# EAGLE schematic bin-clock (EAGLE 6.5.0)
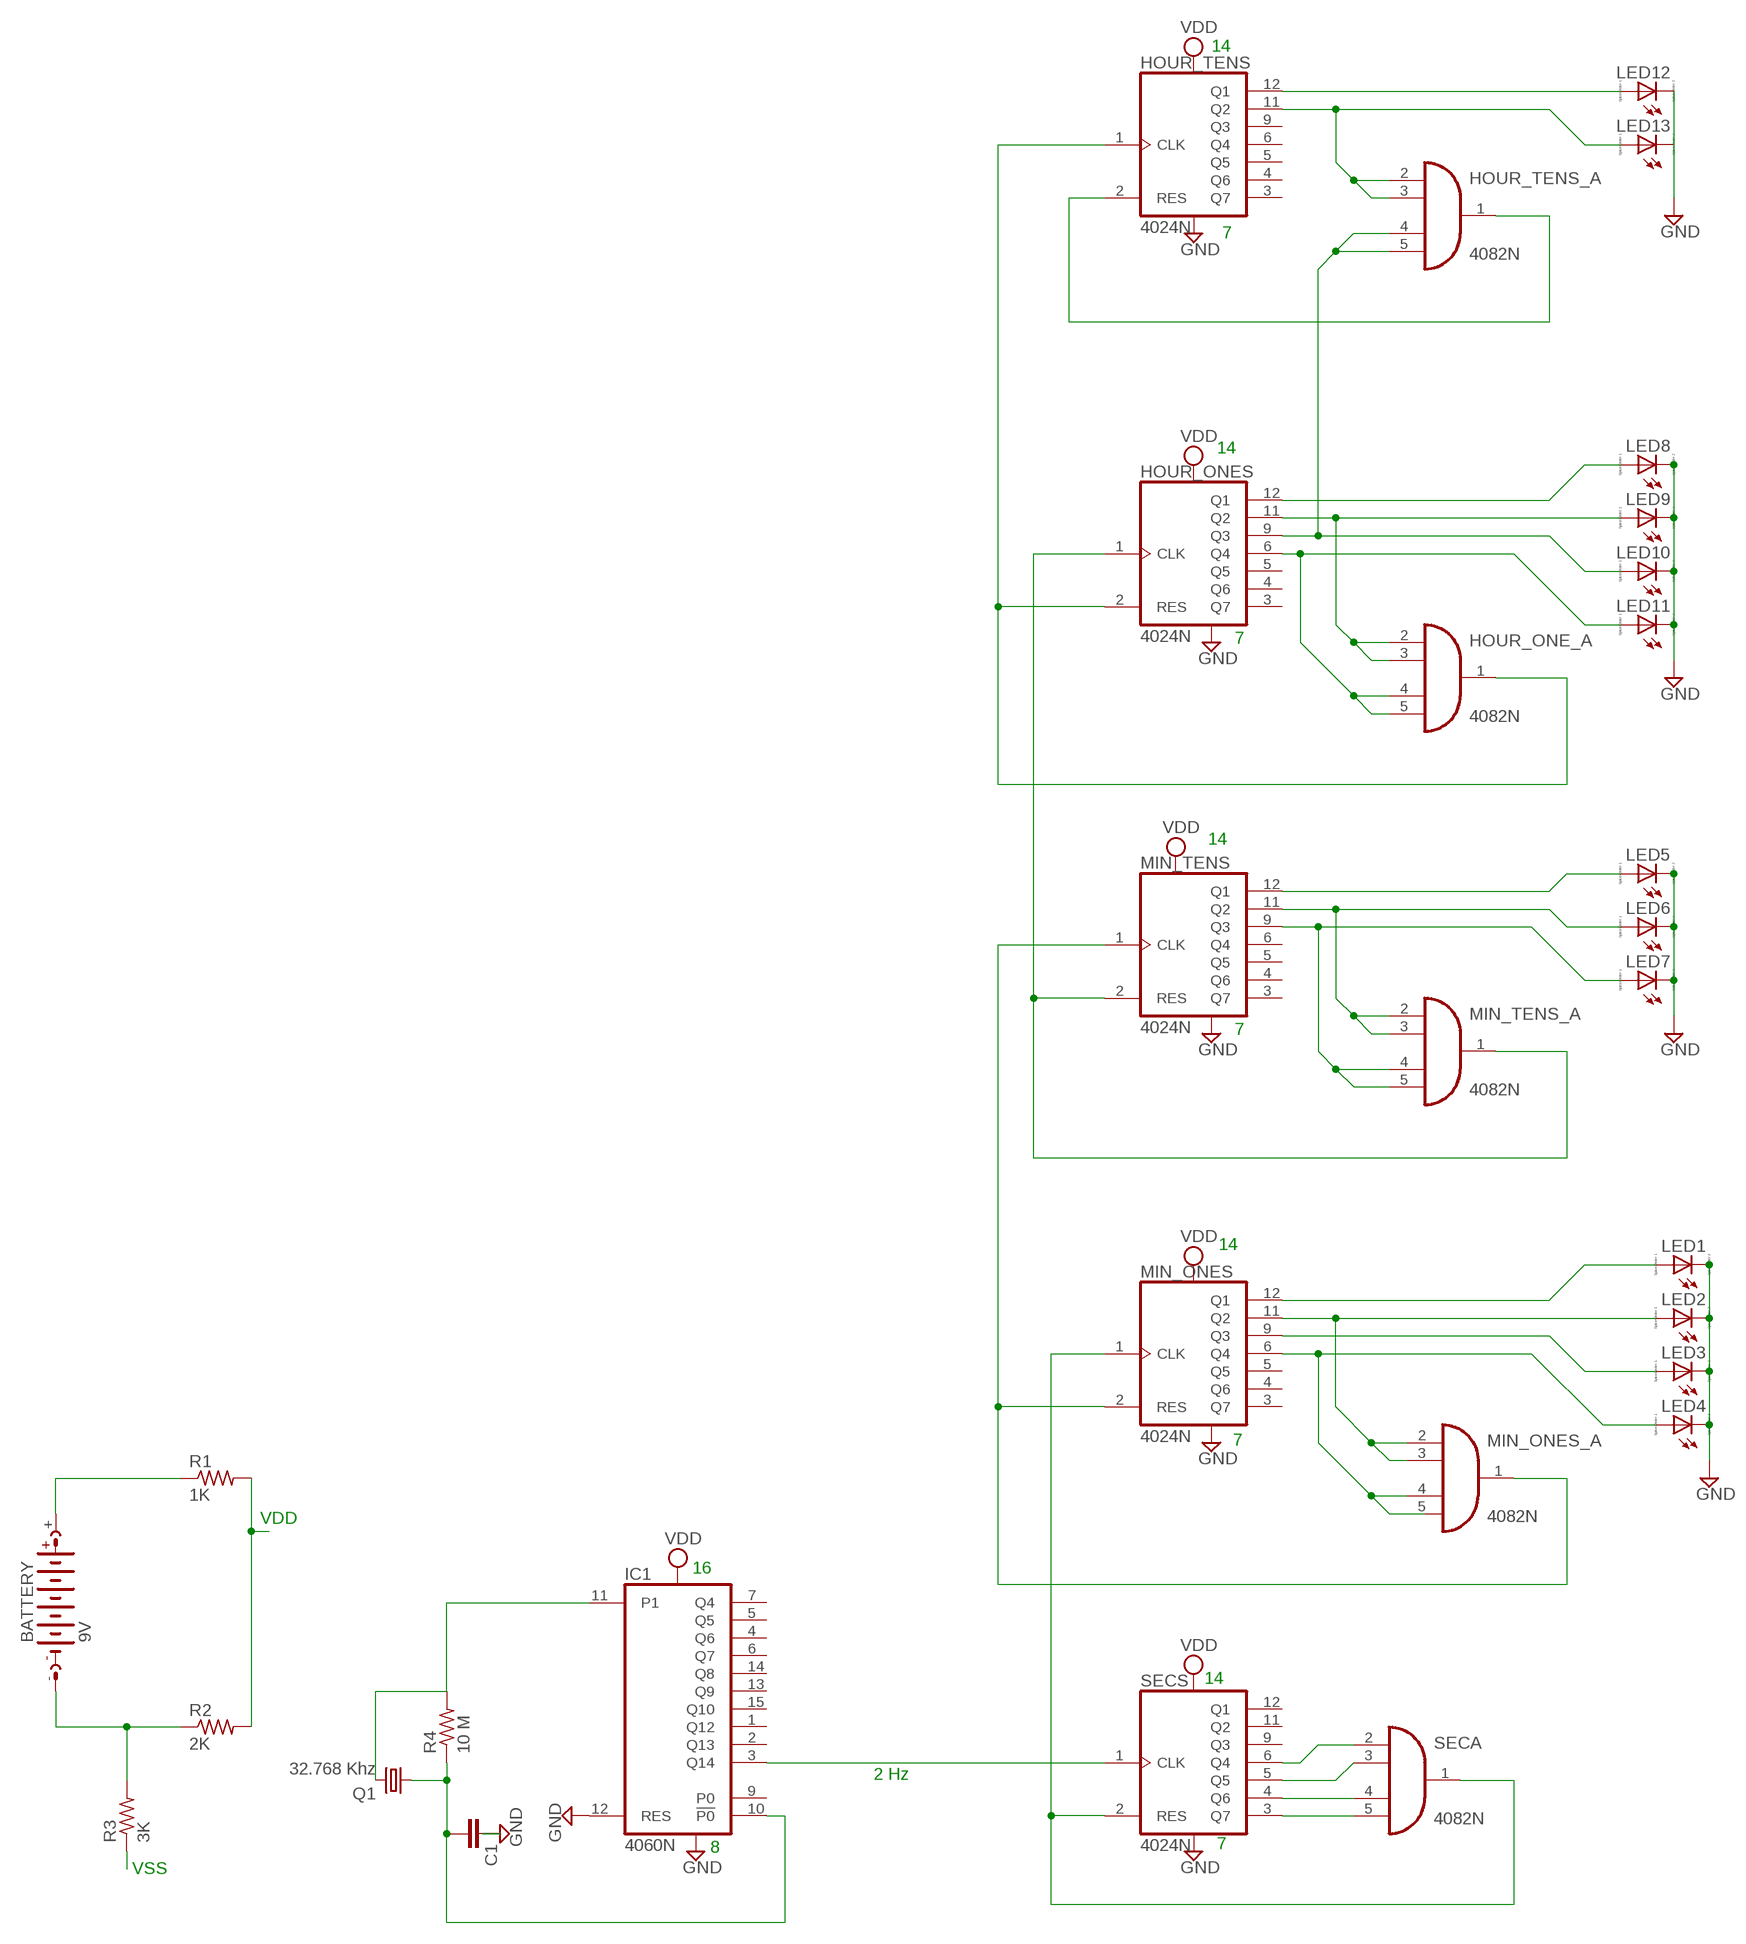
[diagram p0: schematic, sheet 1]

## Parts
BATTERY  9V  AB9V  [AB9V]
C1  C2,5-3  [C2.5-3]
HOUR_ONE_  4082N  [DIL14]
HOUR_ONES  4024N  [DIL14]
HOUR_TENS  4024N  [DIL14]
HOUR_TENS_  4082N  [DIL14]
IC1  4060N  [DIL16]
LED1  LED_ELD260  [LED_LD260]
LED2  LED_ELD260  [LED_LD260]
LED3  LED_ELD260  [LED_LD260]
LED4  LED_ELD260  [LED_LD260]
LED5  LED_ELD260  [LED_LD260]
LED6  LED_ELD260  [LED_LD260]
LED7  LED_ELD260  [LED_LD260]
LED8  LED_ELD260  [LED_LD260]
LED9  LED_ELD260  [LED_LD260]
LED10  LED_ELD260  [LED_LD260]
LED11  LED_ELD260  [LED_LD260]
LED12  LED_ELD260  [LED_LD260]
LED13  LED_ELD260  [LED_LD260]
MIN_ONES  4024N  [DIL14]
MIN_ONES_  4082N  [DIL14]
MIN_TENS  4024N  [DIL14]
MIN_TENS_  4082N  [DIL14]
Q1  32.768 Khz  CRYSTAL68SMX  [86SMX]
R1  1K  R-US_0204/2V  [0204V]
R2  2K  R-US_0204/2V  [0204V]
R3  3K  R-US_0204/2V  [0204V]
R4  10 M  R-US_0204/2V  [0204V]
SEC  4082N  [DIL14]
SECS  4024N  [DIL14]

## Nets
GND: C1.1 IC1.12(RES) LED1.K(C) LED2.K(C) LED3.K(C) LED4.K(C) LED5.K(C) LED6.K(C) LED7.K(C) LED8.K(C) LED9.K(C) LED10.K(C) LED11.K(C) LED12.K(C)
N$1: BATTERY.+ R1.1
N$2: BATTERY.- R2.1 R3.2
N$3: R3.1
N$4: IC1.3(Q14)
N$5: C1.2 IC1.10(!P0) Q1.1 R4.1
N$6: IC1.11(P1) Q1.4 R4.2
N$7: R1.2 R2.2
N$8: SEC.2(A:I0) SECS.6(Q4)
N$9: SEC.3(A:I1) SECS.5(Q5)
N$10: SEC.4(A:I2) SECS.4(Q6)
N$11: SEC.5(A:I3) SECS.3(Q7)
N$12: MIN_ONES.1(CLK) SEC.1(A:O) SECS.2(RES)
N$13: LED1.A MIN_ONES.12(Q1)
N$14: HOUR_ONES.1(CLK) MIN_TENS.2(RES) MIN_TENS_.1(A:O)
N$15: LED3.A MIN_ONES.9(Q3)
N$16: LED4.A MIN_ONES.6(Q4) MIN_ONES_.4(A:I2)
N$17: MIN_ONES.2(RES) MIN_ONES_.1(A:O) MIN_TENS.1(CLK)
N$18: LED5.A MIN_TENS.12(Q1)
N$19: LED6.A MIN_TENS.11(Q2) MIN_TENS_.2(A:I0) MIN_TENS_.3(A:I1)
N$20: LED7.A MIN_TENS.9(Q3) MIN_TENS_.4(A:I2) MIN_TENS_.5(A:I3)
N$21: LED2.A MIN_ONES.11(Q2) MIN_ONES_.2(A:I0) MIN_ONES_.3(A:I1)
N$22: HOUR_ONES.12(Q1) LED8.A
N$23: HOUR_ONE_.2(A:I0) HOUR_ONE_.3(A:I1) HOUR_ONES.11(Q2) LED9.A
N$24: HOUR_ONES.9(Q3) HOUR_TENS_.4(A:I2) HOUR_TENS_.5(A:I3) LED10.A
N$25: HOUR_ONE_.4(A:I2) HOUR_ONE_.5(A:I3) HOUR_ONES.6(Q4) LED11.A
N$26: HOUR_ONE_.1(A:O) HOUR_ONES.2(RES) HOUR_TENS.1(CLK)
N$27: HOUR_TENS.12(Q1) LED12.A
N$28: HOUR_TENS.11(Q2) HOUR_TENS_.2(A:I0) HOUR_TENS_.3(A:I1) LED13.A
N$29: HOUR_TENS.2(RES) HOUR_TENS_.1(A:O)
Unconnected: HOUR_ONE_.9(B:I0) HOUR_ONE_.10(B:I1) HOUR_ONE_.11(B:I2) HOUR_ONE_.12(B:I3) HOUR_ONE_.13(B:O) HOUR_ONES.3(Q7) HOUR_ONES.4(Q6) HOUR_ONES.5(Q5) HOUR_TENS.3(Q7) HOUR_TENS.4(Q6) HOUR_TENS.5(Q5) HOUR_TENS.6(Q4) HOUR_TENS.9(Q3) HOUR_TENS_.9(B:I0) HOUR_TENS_.10(B:I1) HOUR_TENS_.11(B:I2) HOUR_TENS_.12(B:I3) HOUR_TENS_.13(B:O) IC1.1(Q12) IC1.2(Q13) IC1.4(Q6) IC1.5(Q5) IC1.6(Q7) IC1.7(Q4) IC1.9(P0) IC1.13(Q9) IC1.14(Q8) IC1.15(Q10) LED13.K(C) MIN_ONES.3(Q7) MIN_ONES.4(Q6) MIN_ONES.5(Q5) MIN_ONES_.5(A:I3) MIN_ONES_.9(B:I0) MIN_ONES_.10(B:I1) MIN_ONES_.11(B:I2) MIN_ONES_.12(B:I3) MIN_ONES_.13(B:O) MIN_TENS.3(Q7) MIN_TENS.4(Q6) MIN_TENS.5(Q5) MIN_TENS.6(Q4) MIN_TENS_.9(B:I0) MIN_TENS_.10(B:I1) MIN_TENS_.11(B:I2) MIN_TENS_.12(B:I3) MIN_TENS_.13(B:O) SEC.9(B:I0) SEC.10(B:I1) SEC.11(B:I2) SEC.12(B:I3) SEC.13(B:O) SECS.1(CLK) SECS.9(Q3) SECS.11(Q2) SECS.12(Q1)

## Notes on the sheet
- 14
- 7
- 14
- 7
- 14
- 7
- 14
- 7
- VDD
- 16
- 14
- 2 Hz
- 8 | 7
- VSS

## Power pins joined to a net without a drawn wire
VDD: HOUR_ONE_.14(P:VDD) HOUR_ONES.14(VDD) HOUR_TENS.14(VDD) HOUR_TENS_.14(P:VDD) IC1.16(VDD) MIN_ONES.14(VDD) MIN_ONES_.14(P:VDD) MIN_TENS.14(VDD) MIN_TENS_.14(P:VDD) SEC.14(P:VDD) SECS.14(VDD)
VSS: HOUR_ONE_.7(P:VSS) HOUR_ONES.7(VSS) HOUR_TENS.7(VSS) HOUR_TENS_.7(P:VSS) IC1.8(VSS) MIN_ONES.7(VSS) MIN_ONES_.7(P:VSS) MIN_TENS.7(VSS) MIN_TENS_.7(P:VSS) SEC.7(P:VSS) SECS.7(VSS)

## Library data of the parts
BATTERY = battery:AB9V: 9-V BATTERY CLIP
C1 = capacitor-wima:C: CAPACITOR naming: grid - package width
HOUR_ONE_ HOUR_TENS_ MIN_ONES_ MIN_TENS_ SEC = 40xx:4082: Dual 4-input AND
HOUR_ONES HOUR_TENS MIN_ONES MIN_TENS SECS = 40xx:4024: 7-stage binary/ripple COUNTER
IC1 = 40xx:4060: 14-stage binary/ripple COUNTER
LED1-LED13 = eagle-ltspice:LED_E: LED Source: http://www.osram.convergy.de Source: www.luxeon.com Source: www.kingbright.com; SPICEMODEL: NONE; SPICEPREFIX: D; SPICETYPE: diode
Q1 = crystal:CRYSTAL: CRYSTAL; OC_FARNELL: 6344860; OC_NEWARK: unknown
R1-R3 = resistor:R-US_: RESISTOR, American symbol
R4 = rcl:R-US_: RESISTOR, American symbol